# Altium project EE4951_BPM_REV_B.PrjPcb
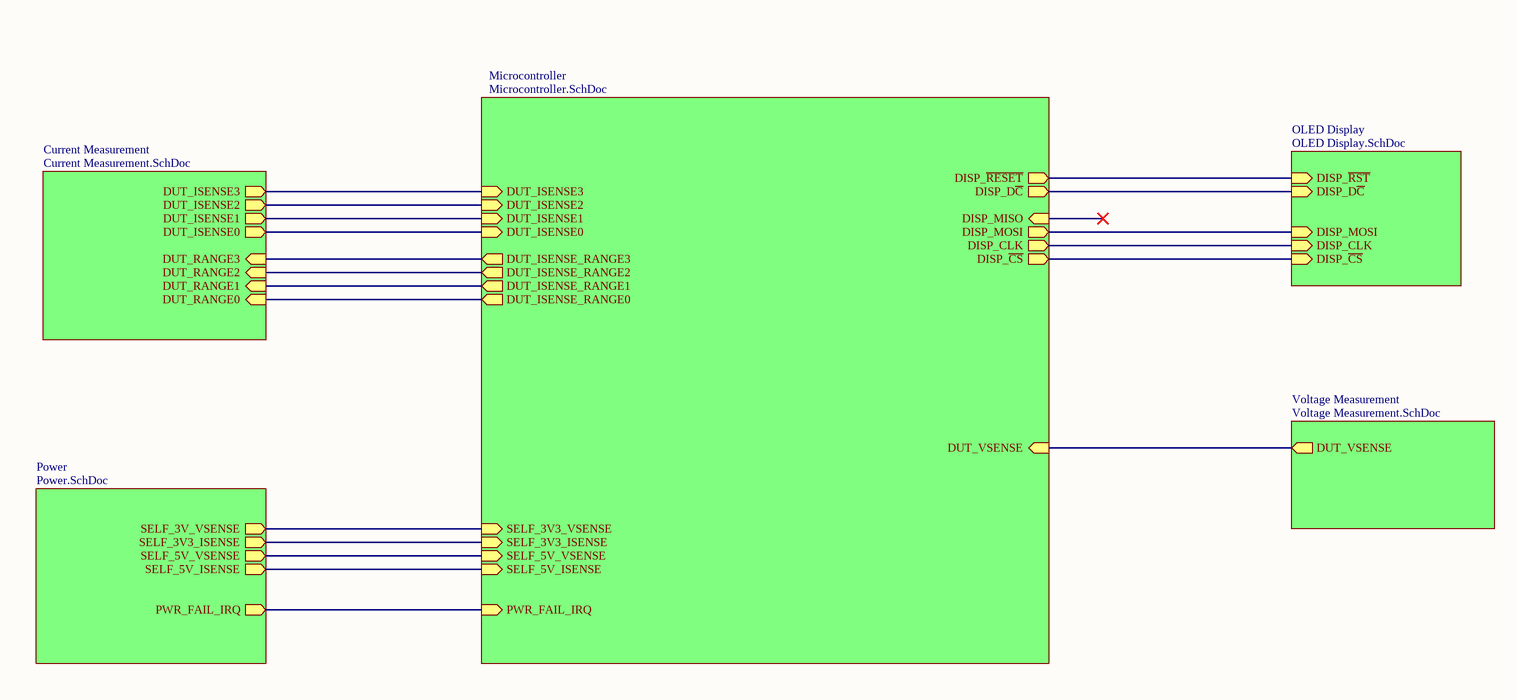
[diagram p0: Heirarchy.SchDoc, left]
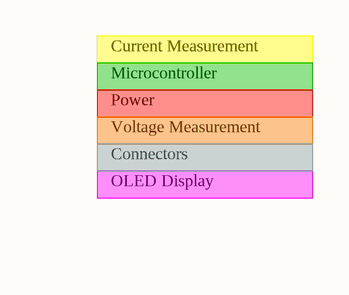
[diagram p1: Heirarchy.SchDoc, right]
3 sheets, 120 parts. Net scope: hierarchical (ports join the sheet entries above them; power ports are global).
Board file: EE4951_BPM_REVA.PcbDoc
Sheets:
  Heirarchy.SchDoc
    Power = Power.SchDoc
    OLED Display = OLED Display.SchDoc

## Sheet Heirarchy.SchDoc
size D; DrawnBy: Ross Harvey; Engineer: Ross Harvey; Revision: A; SheetNumber: 1; SheetTotal: 7

### Sub-sheets
Current Measurement = Current Measurement.SchDoc (file not in this document): DUT_ISENSE2 (out), DUT_ISENSE1 (out), DUT_RANGE2 (in), DUT_RANGE0 (in), DUT_ISENSE3 (out), DUT_RANGE3 (in), DUT_RANGE1 (in), DUT_ISENSE0 (out)
Microcontroller = Microcontroller.SchDoc (file not in this document): DISP_MISO (in), SELF_3V3_ISENSE (in), DISP_CLK (out), PWR_FAIL_IRQ (in), DISP_~{CS} (out), DUT_ISENSE_RANGE1 (out), SELF_5V_VSENSE (in), DUT_ISENSE_RANGE0 (out), DISP_MOSI (out), SELF_5V_ISENSE (in), DUT_VSENSE (in), DUT_ISENSE_RANGE2 (out), DISP_D~{C} (out), DUT_ISENSE_RANGE3 (out), DUT_ISENSE0 (in), DISP_~{RESET} (out), DUT_ISENSE2 (in), DUT_ISENSE3 (in), DUT_ISENSE1 (in), SELF_3V3_VSENSE (in)
OLED Display = OLED Display.SchDoc: DISP_~{CS} (in), DISP_CLK (in), DISP_MOSI (in), DISP_~{RST} (in), DISP_D~{C} (in)
Power = Power.SchDoc: SELF_5V_VSENSE (out), SELF_5V_ISENSE (out), SELF_3V3_ISENSE (out), PWR_FAIL_IRQ (out), SELF_3V_VSENSE (out)
Voltage Measurement = Voltage Measurement.SchDoc (file not in this document): DUT_VSENSE (out)

### Nets
NetC48_1: sheet Microcontroller/SELF_5V_ISENSE, sheet Power/SELF_5V_ISENSE
NetC49_1: sheet Microcontroller/SELF_5V_VSENSE, sheet Power/SELF_5V_VSENSE
NetC54_1: sheet Microcontroller/SELF_3V3_ISENSE, sheet Power/SELF_3V3_ISENSE
NetC70_1: sheet Microcontroller/SELF_3V3_VSENSE, sheet Power/SELF_3V_VSENSE
NetU14_1: sheet Microcontroller/PWR_FAIL_IRQ, sheet Power/PWR_FAIL_IRQ
NetU16_1: sheet Microcontroller/DISP_MOSI, sheet OLED Display/DISP_MOSI
NetU16_2: sheet Microcontroller/DISP_CLK, sheet OLED Display/DISP_CLK
NetU16_3: sheet Microcontroller/DISP_D~{C}, sheet OLED Display/DISP_D~{C}
NetU16_4: sheet Microcontroller/DISP_~{RESET}, sheet OLED Display/DISP_~{RST}
NetU16_5: sheet Microcontroller/DISP_~{CS}, sheet OLED Display/DISP_~{CS}
(unnamed): sheet Current Measurement/DUT_ISENSE2, sheet Microcontroller/DUT_ISENSE2
(unnamed): sheet Current Measurement/DUT_ISENSE1, sheet Microcontroller/DUT_ISENSE1
(unnamed): sheet Current Measurement/DUT_RANGE2, sheet Microcontroller/DUT_ISENSE_RANGE2
(unnamed): sheet Current Measurement/DUT_RANGE0, sheet Microcontroller/DUT_ISENSE_RANGE0
(unnamed): sheet Current Measurement/DUT_ISENSE3, sheet Microcontroller/DUT_ISENSE3
(unnamed): sheet Current Measurement/DUT_RANGE3, sheet Microcontroller/DUT_ISENSE_RANGE3
(unnamed): sheet Current Measurement/DUT_RANGE1, sheet Microcontroller/DUT_ISENSE_RANGE1
(unnamed): sheet Current Measurement/DUT_ISENSE0, sheet Microcontroller/DUT_ISENSE0
(unnamed): sheet Microcontroller/DUT_VSENSE, sheet Voltage Measurement/DUT_VSENSE

### Notes on the sheet
- Current Measurement
- Microcontroller
- Power
- Voltage Measurement
- Connectors
- OLED Display

## Sheet Power.SchDoc
size D; DrawnBy: James Redinger/Ross Harvey; Engineer: JR/AB/RH; Revision: A; SheetNumber: 4; SheetTotal: 7
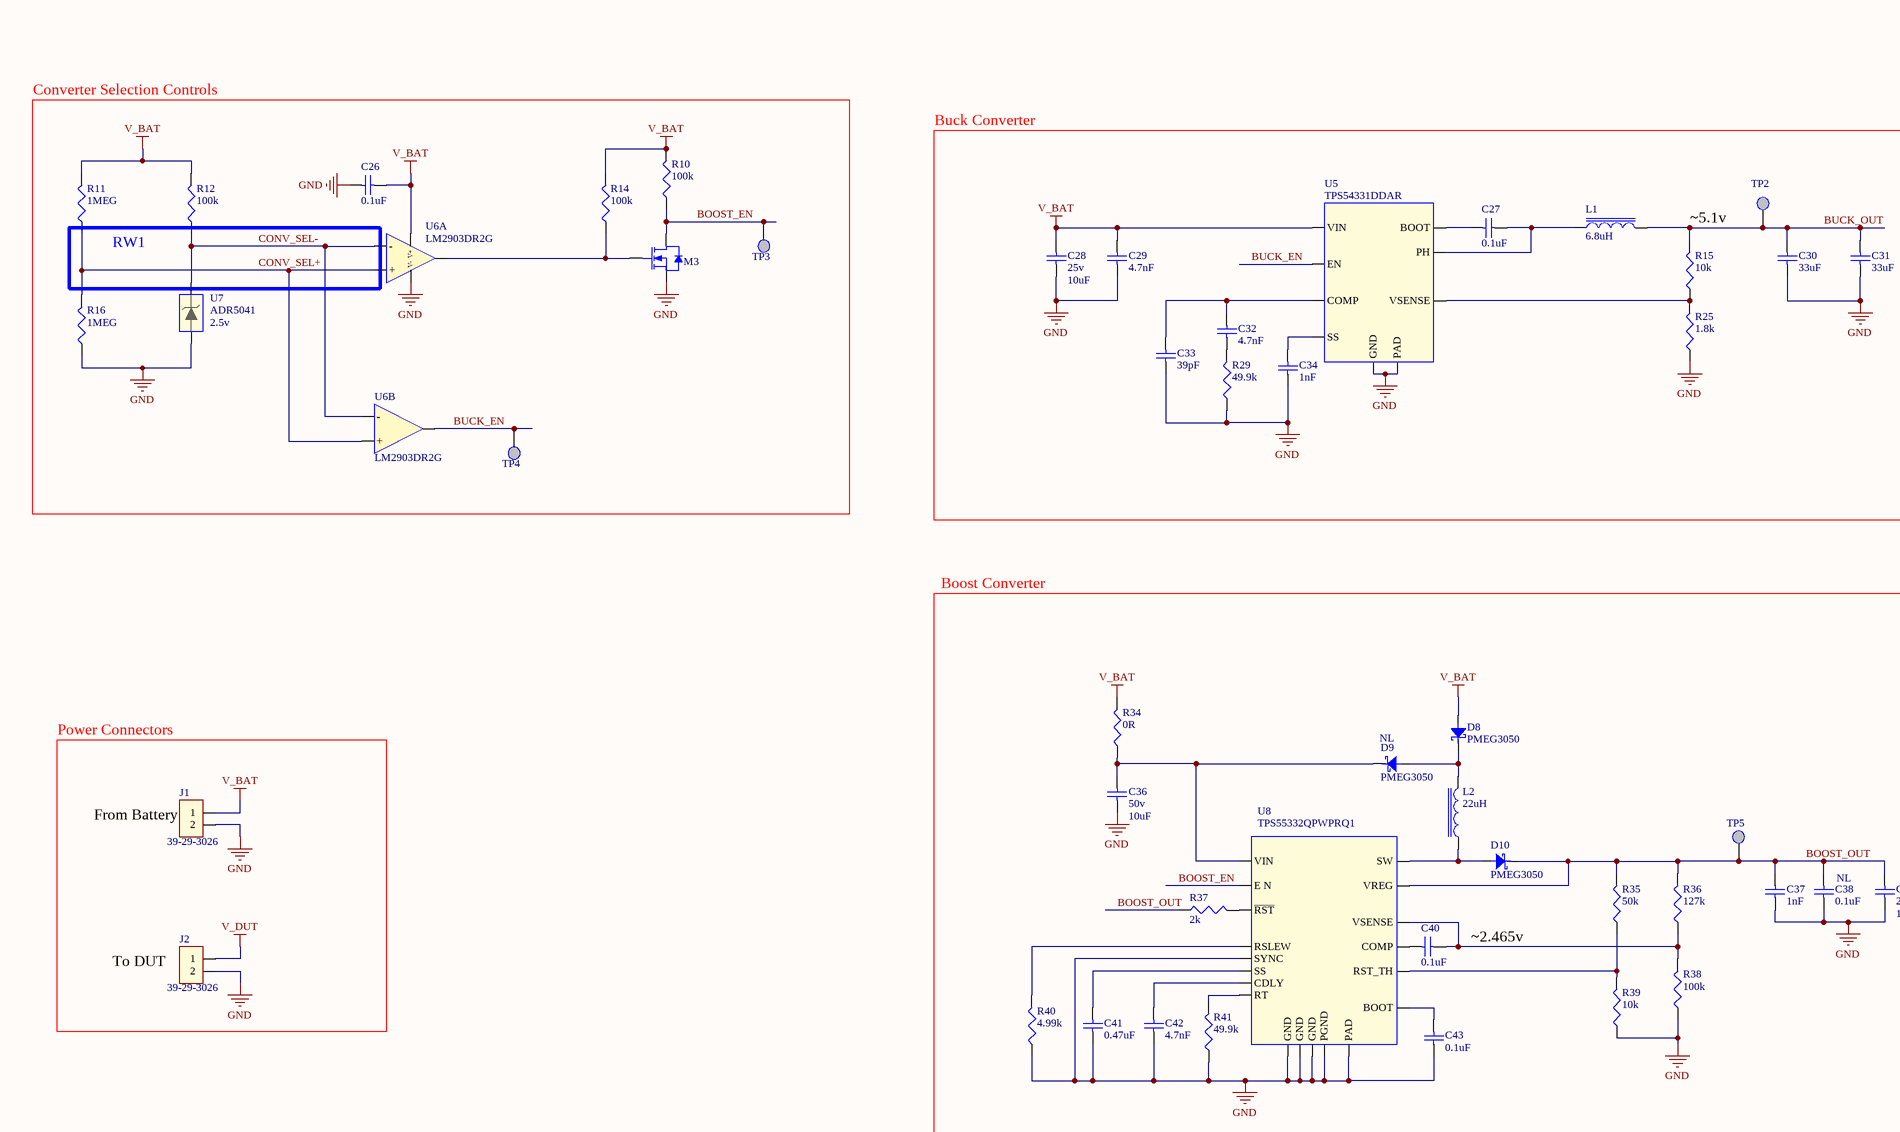
[diagram p2: Power.SchDoc, top left]
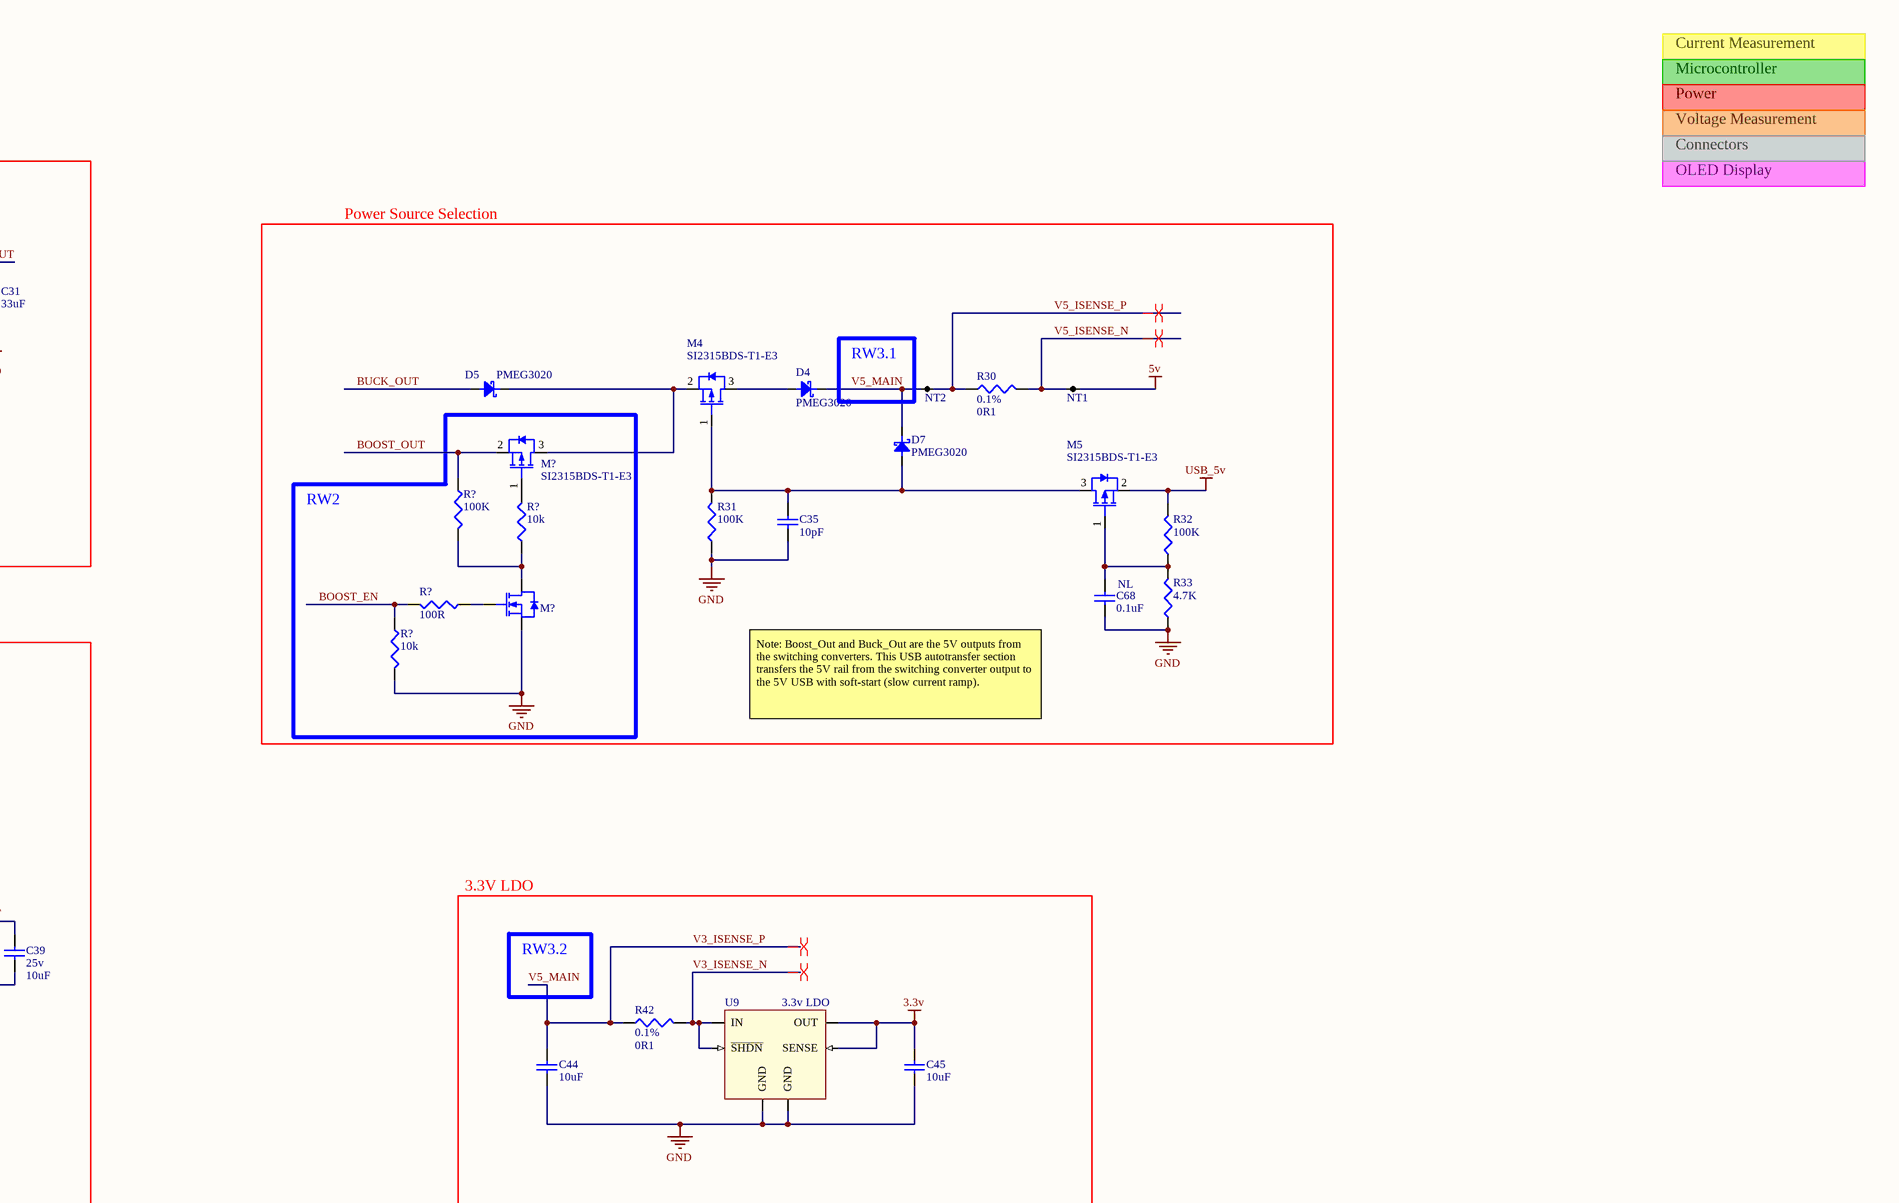
[diagram p3: Power.SchDoc, top right]
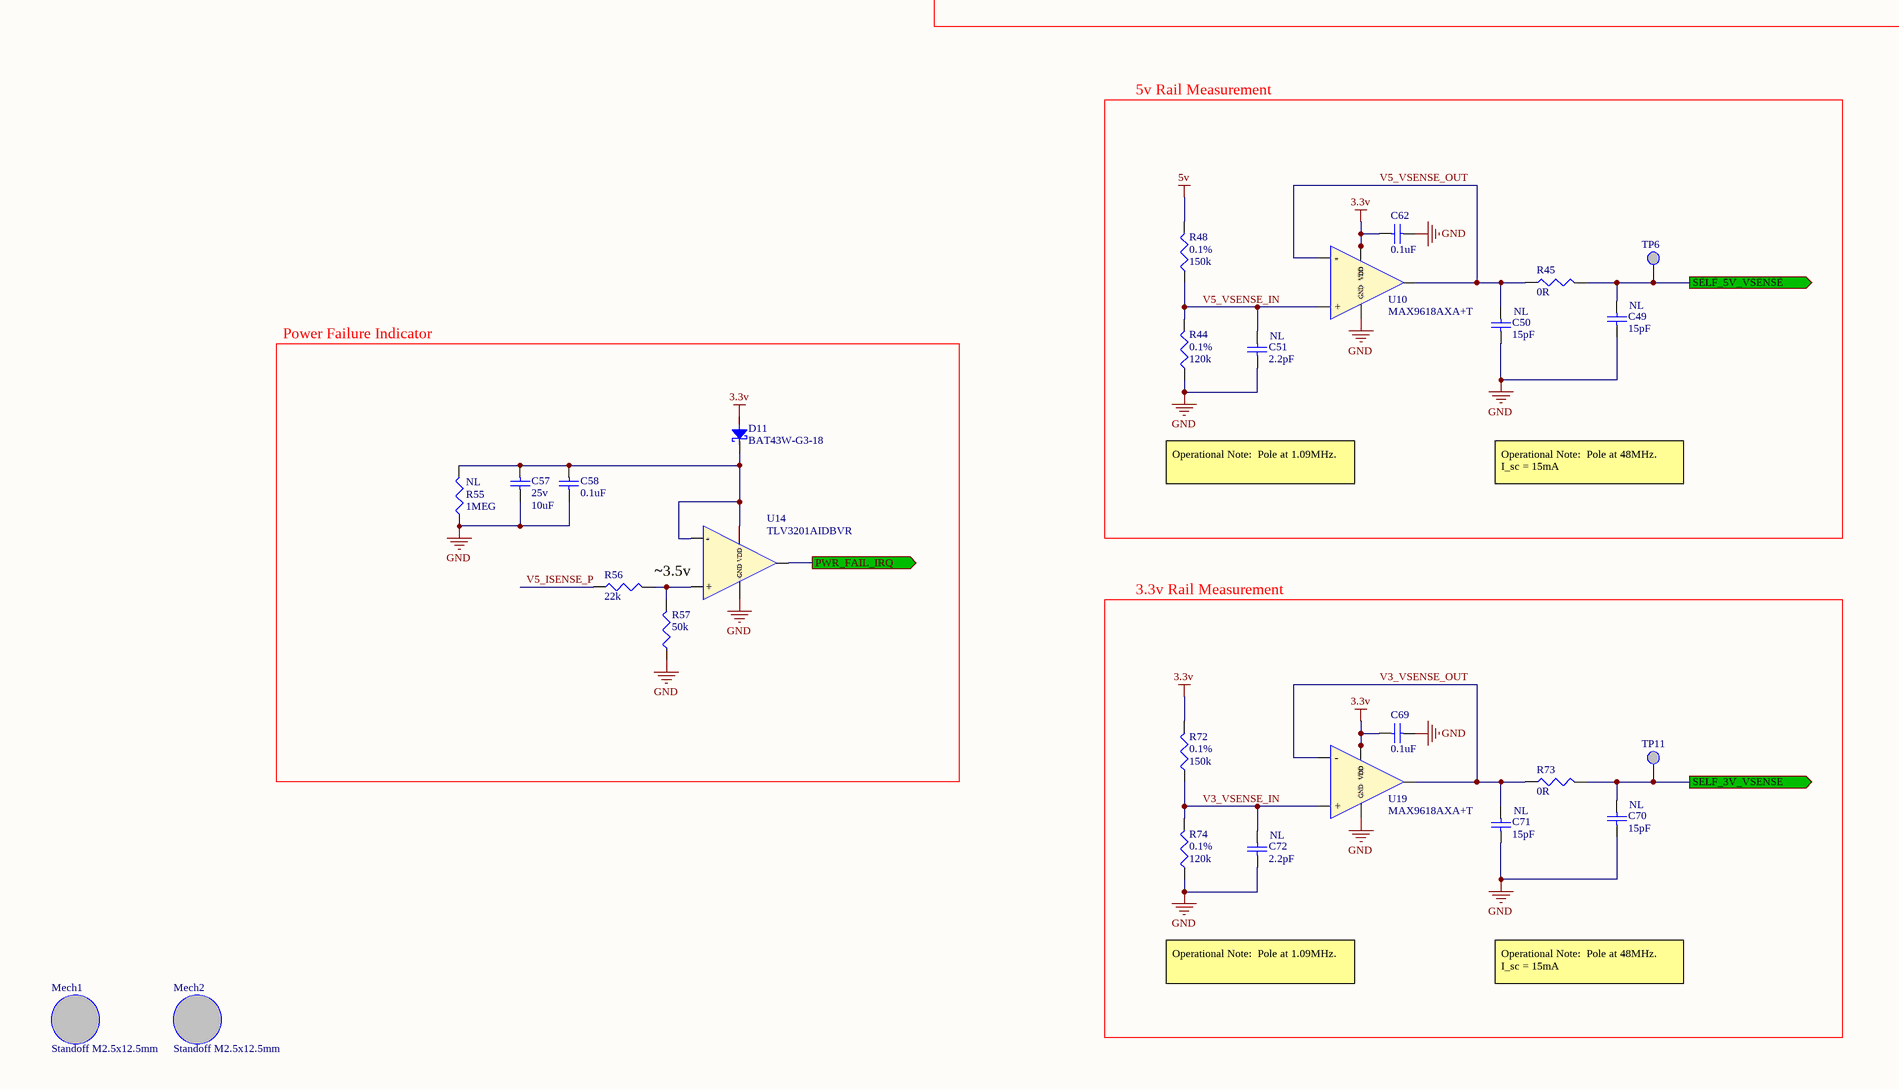
[diagram p4: Power.SchDoc, bottom left]
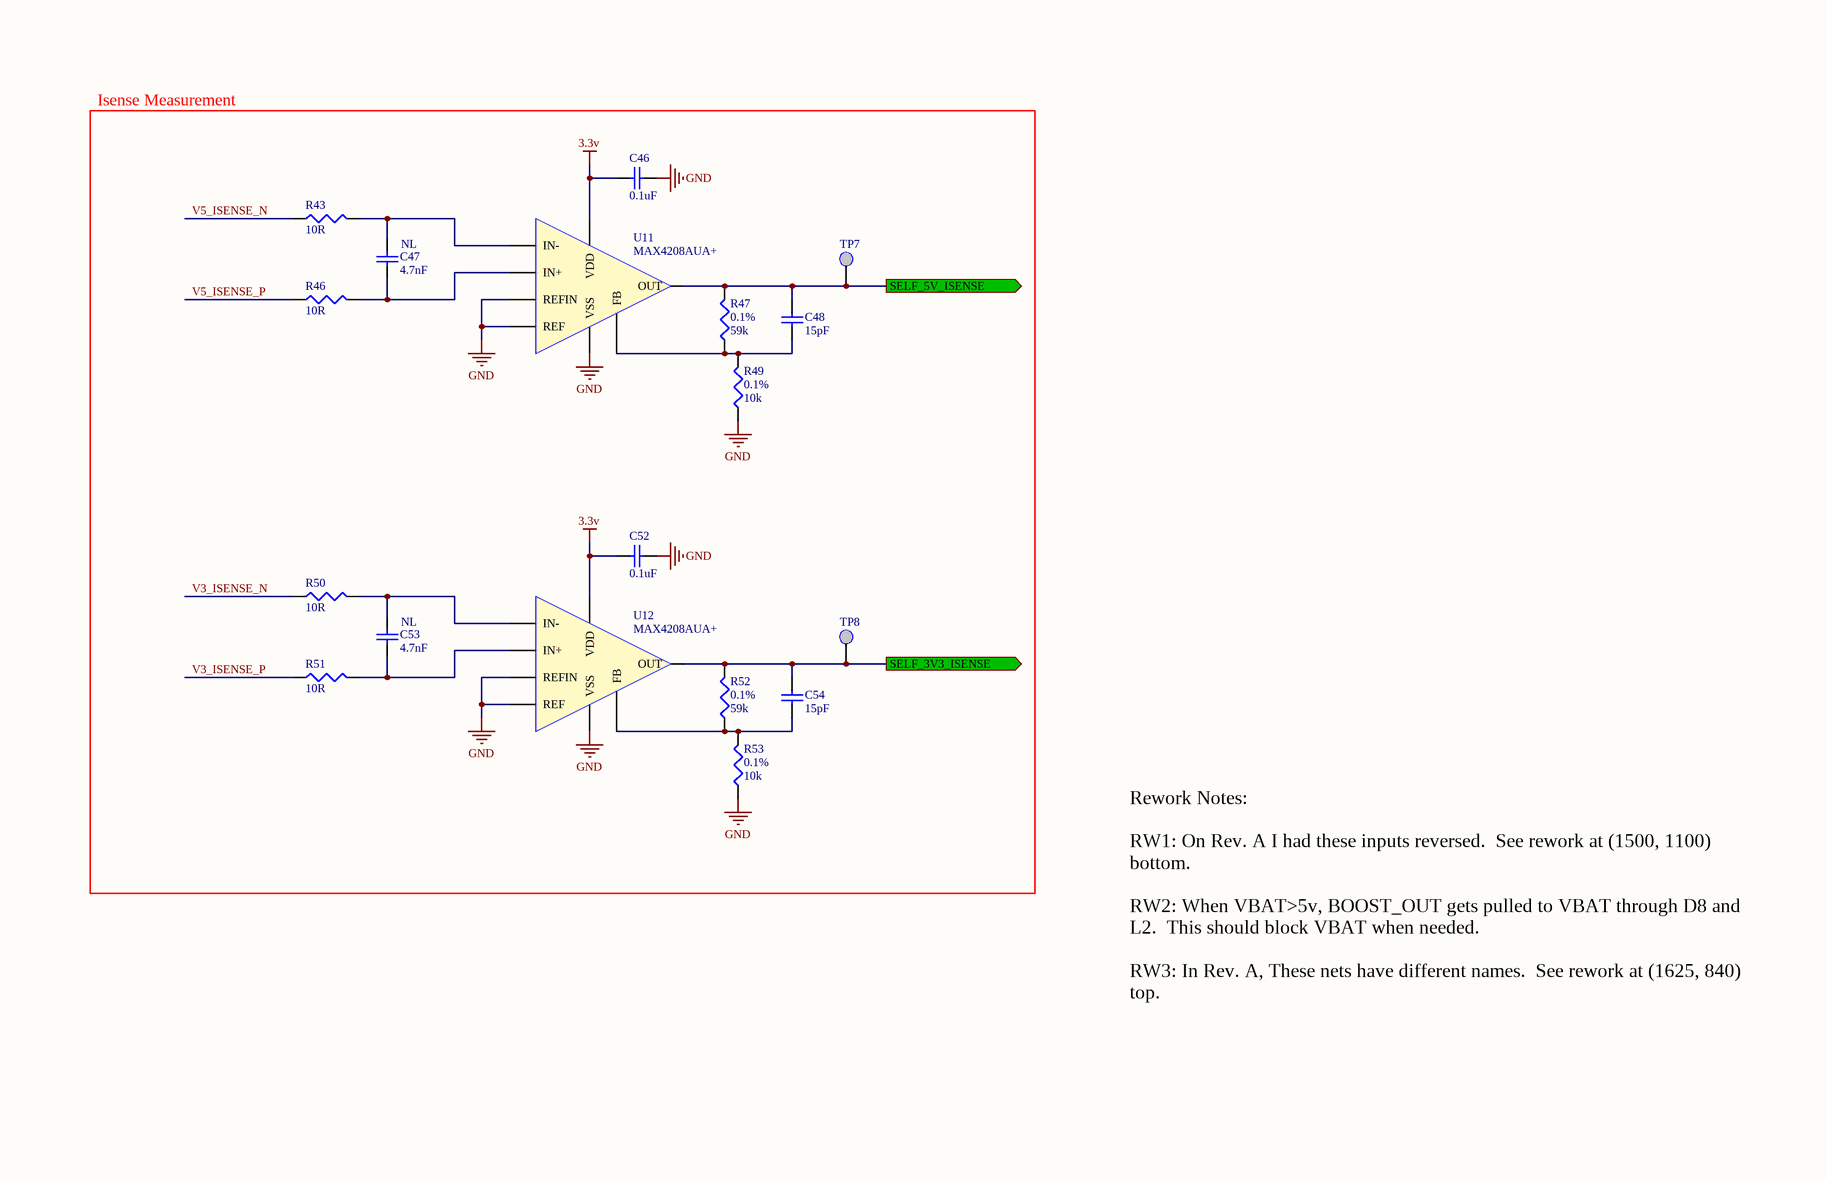
[diagram p5: Power.SchDoc, bottom right]

### Parts
(Parts that share a designator on the sheet are numbered #1, #2 ... from top to bottom, then left to right.)
C26  0.1uF  [CAP0603R]
C27  0.1uF  [CAP0603R]
C28  Voltage: 25v  [CAP1206W]  (hidden comment: 10uF)
C29  4.7nF  [CAP0402R]
C30  33uF  [CAP0805R]
C31  33uF  [CAP0805R]
C32  4.7nF  [CAP0402R]
C33  39pF  [CAP0402R]
C34  1nF  [CAP0402R]
C35  10pF  [CAP0402R]
C36  Voltage: 50v  [CAP1206R]  (hidden comment: 10uF)
C37  1nF  [CAP0402R]
C38  LOAD: NL  [CAP0402R]  (hidden comment: 0.1uF)
C39  Voltage: 25v  [CAP1206W]  (hidden comment: 10uF)
C40  0.1uF  [CAP0402R]
C41  0.47uF  [CAP0805R]
C42  4.7nF  [CAP0402R]
C43  0.1uF  [CAP0603R]
C44  10uF  [CAP0805R]
C45  10uF  [CAP0805R]
C46  0.1uF  [CAP0402R]
C47  LOAD: NL  [CAP0402R]  (hidden comment: 4.7nF)
C48  15pF  [CAP0402R]
C49  LOAD: NL  [CAP0402R]  (hidden comment: 15pF)
C50  LOAD: NL  [CAP0402R]  (hidden comment: 15pF)
C51  LOAD: NL  [CAP0402R]  (hidden comment: 2.2pF)
C52  0.1uF  [CAP0402R]
C53  LOAD: NL  [CAP0402R]  (hidden comment: 4.7nF)
C54  15pF  [CAP0402R]
C57  Voltage: 25v  [CAP1206W]  (hidden comment: 10uF)
C58  0.1uF  [CAP0402R]
C62  0.1uF  [CAP0402R]
C68  LOAD: NL  [CAP0402R]  (hidden comment: 0.1uF)
C69  0.1uF  [CAP0402R]
C70  LOAD: NL  [CAP0402R]  (hidden comment: 15pF)
C71  LOAD: NL  [CAP0402R]  (hidden comment: 15pF)
C72  LOAD: NL  [CAP0402R]  (hidden comment: 2.2pF)
D4  PMEG3020  [SOD-123]
D5  PMEG3020  [SOD-123]
D7  PMEG3020  [SOD-123]
D8  PMEG3050  [SOD128]
D9  PMEG3050  LOAD: NL  [SOD128]
D10  PMEG3050  [SOD128]
D11  BAT43W-G3-18  [SOD-123]
J1  39-29-3026  [1x2 MicroFit]
J2  39-29-3026  [1x2 MicroFit]
L1  6.8uH  [CDRH3D28NP-6R8NC]
L2  22uH  [Bourns_SRR1210]
M3  2N7002P,215  [SOT23-3M]  (value not drawn)
M4  SI2315BDS-T1-E3  [SOT23-3M]
M5  SI2315BDS-T1-E3  [SOT23-3M]
M?#1  SI2315BDS-T1-E3  [SOT23-3M]
M?#2  2N7002P,215  [SOT23-3M]  (value not drawn)
Mech1  Standoff M2.5x12.5mm  [Standoff M2.5x12mm]
Mech2  Standoff M2.5x12.5mm  [Standoff M2.5x12mm]
NT1  Net Tie  [Net Tie]  (value not drawn)  (net tie)
NT2  Net Tie  [Net Tie]  (value not drawn)  (net tie)
R10  100k  [RES0402R]
R11  1MEG  [RES0402R]
R12  100k  [RES0402R]
R14  100k  [RES0402R]
R15  10k  [RES0402R]
R16  1MEG  [RES0402R]
R25  1.8k  [RES0402R]
R29  49.9k  [RES0402R]
R30  Tolerance: 0.1%  [RES1206R]  (hidden comment: 0R1)
R31  100K  [RES0402R]
R32  100K  [RES0402R]
R33  4.7K  [RES0402R]
R34  0R  [RES1206W]
R35  50k  [RES0402R]
R36  127k  [RES0402R]
R37  2k  [RES0402R]
R38  100k  [RES0402R]
R39  10k  [RES0402R]
R40  4.99k  [RES0402R]
R41  49.9k  [RES0402R]
R42  Tolerance: 0.1%  [RES1206R]  (hidden comment: 0R1)
R43  10R  [RES0402R]
R44  Tolerance: 0.1%  [RES0603R]  (hidden comment: 120k)
R45  0R  [RES0402R]
R46  10R  [RES0402R]
R47  Tolerance: 0.1%  [RES0603R]  (hidden comment: 59k)
R48  Tolerance: 0.1%  [RES0603R]  (hidden comment: 150k)
R49  Tolerance: 0.1%  [RES0603R]  (hidden comment: 10k)
R50  10R  [RES0402R]
R51  10R  [RES0402R]
R52  Tolerance: 0.1%  [RES0603R]  (hidden comment: 59k)
R53  Tolerance: 0.1%  [RES0603R]  (hidden comment: 10k)
R55  Load: NL  [RES0402R]  (hidden comment: 1MEG)
R56  22k  [RES0603W]
R57  50k  [RES0402R]
R72  Tolerance: 0.1%  [RES0603R]  (hidden comment: 150k)
R73  0R  [RES0402R]
R74  Tolerance: 0.1%  [RES0603R]  (hidden comment: 120k)
R?#1  100K  [RES0402R]
R?#2  10k  [RES0402R]
R?#3  100R  [RES0402R]
R?#4  10k  [RES0402R]
TP2  NONE  [TESTPOINT - 1.5mm Round Pad]  (value not drawn)
TP3  NONE  [TESTPOINT - 1.5mm Round Pad]  (value not drawn)
TP4  NONE  [TESTPOINT - 1.5mm Round Pad]  (value not drawn)
TP5  NONE  [TESTPOINT - 1.5mm Round Pad]  (value not drawn)
TP6  NONE  [TESTPOINT - 1.5mm Round Pad]  (value not drawn)
TP7  NONE  [TESTPOINT - 1.5mm Round Pad]  (value not drawn)
TP8  NONE  [TESTPOINT - 1.5mm Round Pad]  (value not drawn)
TP11  NONE  [TESTPOINT - 1.5mm Round Pad]  (value not drawn)
U5  TPS54331DDAR  [HSOP-8]
U6  LM2903DR2G  [SOIC-8]  (parts A,B of 2)
U7  ADR5041  VOLTAGE: 2.5v  [SOT23-3M]
U8  TPS55332QPWPRQ1  [HTSSOP-20]
U9  3.3v LDO  [SOT-223-6]
U10  MAX9618AXA+T  [SC70]
U11  MAX4208AUA+  [uMAX8]
U12  MAX4208AUA+  [uMAX8]
U14  TLV3201AIDBVR  [SOT23-5]
U19  MAX9618AXA+T  [SC70]

### Blocks framed on the sheet
RW2: M?#1 M?#2 R?#1-R?#4
5v Rail Measurement: C49-C51 C62 R44 R45 R48 TP6 U10
Isense Measurement: C46-C48 C52-C54 R43 R46 R47 R49-R53 TP7 TP8 U11 U12
3.3v Rail Measurement: C69-C72 R72-R74 TP11 U19

### Ports
PWR_FAIL_IRQ (out), SELF_3V3_ISENSE (out), SELF_3V_VSENSE (out), SELF_5V_ISENSE (out), SELF_5V_VSENSE (out)

### Nets
3.3v: C45.1 C46.1 C52.1 C62.1 C69.1 D11.2(A) R72.2 U9.4(OUT) U9.5(SENSE) U10.5(VDD) U10.6(VDD) U11.8(VDD) U12.8(VDD) U19.5(VDD) U19.6(VDD)
5v: NT1.2 R48.2
GND: C26.1 C28.2 C29.1 C30.2 C31.2 C33.1 C34.2 C35.2 C36.2 C37.2 C38.2 C39.2 C41.1 C42.2 C43.2 C44.2 C45.2 C46.2 C49.2 C50.2 C51.2 C52.2 C57.2 C58.2 C62.2 C68.2 C69.2 C70.2 C71.2 C72.2 J1.2 J2.2 M3.2(SOURCE) M?#2.2(SOURCE) R16.1 R25.1 R29.1 R31.1 R33.1 R38.1 R39.1 R40.1 R41.1 R44.1 R49.1 R53.1 R55.1 R57.1 R74.1 R?#4.2 U5.7(GND) U5.9(PAD) U6.4(V-) U7.2(K) U8.0(PAD) U8.1(NC) U8.2(NC) U8.3(SYNC) U8.4(GND) U8.10(GND) U8.12(GND) U8.17(PGND) U9.3(GND) U9.6(GND) U10.2(GND) U11.1(REFIN) U11.4(VSS) U11.5(REF) U12.1(REFIN) U12.4(VSS) U12.5(REF) U14.2(GND) U19.2(GND)
USB_5v: M5.2(DRAIN) R32.2
V_BAT: C26.2 C28.1 C29.2 D8.2(A) J1.1 R10.2 R11.2 R12.2 R14.2 R34.2 U5.2(VIN) U6.8(V+)
V_DUT: J2.1
BOOST_EN: M3.3(DRAIN) R10.1 R?#3.2 R?#4.1 TP3.1 U8.5(E_N)
BOOST_OUT: C37.1 C38.1 C39.1 D10.1(K) M?#1.2(DRAIN) R35.2 R36.2 R37.1 R?#1.1 TP5.1 U8.16(VREG)
BUCK_EN: TP4.1 U5.3(EN) U6.7(OUT)
BUCK_OUT: C30.1 C31.1 D5.2(A) L1.2 R15.2 TP2.1
CONV_SEL+: R11.1 R16.2 U6.3(+) U6.5(+)
CONV_SEL-: R12.1 U6.2(-) U6.6(-) U7.1(A)
V3_ISENSE_N: R42.2 R50.1 U9.1(~{SHDN}) U9.2(IN)
V3_ISENSE_P: C44.1 D4.1(K) D7.1(K) NT2.2 R42.1 R51.1  [also labelled V5_MAIN]
V3_VSENSE_IN: C72.1 R72.1 R74.2 U19.1(+)
V3_VSENSE_OUT: C71.1 R73.1 U19.3(-) U19.4(OUT)
V5_ISENSE_N: NT1.1 R30.2 R43.1
V5_ISENSE_P: NT2.1 R30.1 R46.1 R56.1
V5_VSENSE_IN: C51.1 R44.2 R48.1 U10.1(+)
V5_VSENSE_OUT: C50.1 R45.1 U10.3(-) U10.4(OUT)
NetC27_1: C27.1 U5.1(BOOT)
NetC27_2: C27.2 L1.1 U5.8(PH)
NetC32_1: C32.1 R29.2
NetC32_2: C32.2 C33.2 U5.6(COMP)
NetC34_1: C34.1 U5.4(SS)
NetC35_1: C35.1 D7.2(A) M4.1(GATE) M5.3(SOURCE) R31.2
NetC36_1: C36.1 D9.1(K) R34.1 U8.19(VIN)
NetC40_1: C40.1 U8.15(COMP)
NetC40_2: C40.2 R36.1 R38.2 U8.14(VSENSE)
NetC41_2: C41.2 U8.11(SS)
NetC42_1: C42.1 U8.9(CDLY)
NetC43_1: C43.1 U8.20(BOOT)
NetC47_1: C47.1 R43.2 U11.2(IN-)
NetC47_2: C47.2 R46.2 U11.3(IN+)
NetC48_1: C48.1 R47.2 TP7.1 U11.7(OUT) ; port SELF_5V_ISENSE
NetC48_2: C48.2 R47.1 R49.2 U11.6(FB)
NetC49_1: C49.1 R45.2 TP6.1 ; port SELF_5V_VSENSE
NetC53_1: C53.1 R50.2 U12.2(IN-)
NetC53_2: C53.2 R51.2 U12.3(IN+)
NetC54_1: C54.1 R52.2 TP8.1 U12.7(OUT) ; port SELF_3V3_ISENSE
NetC54_2: C54.2 R52.1 R53.2 U12.6(FB)
NetC57_1: C57.1 C58.1 D11.1(K) R55.2 U14.4(-) U14.5(VDD)
NetC68_1: C68.1 M5.1(GATE) R32.1 R33.2
NetC70_1: C70.1 R73.2 TP11.1 ; port SELF_3V_VSENSE
NetD4_2: D4.2(A) M4.3(SOURCE)
NetD5_1: D5.1(K) M4.2(DRAIN) M?#1.3(SOURCE)
NetD8_1: D8.1(K) D9.2(A) L2.2
NetD10_2: D10.2(A) L2.1 U8.18(SW)
NetM3_1: M3.1(GATE) R14.1 U6.1(OUT1)
NetM?#1_1: M?#1.1(GATE) R?#2.2
NetM?#2_1: M?#2.1(GATE) R?#3.1
NetM?#2_3: M?#2.3(DRAIN) R?#1.2 R?#2.1
NetR15_1: R15.1 R25.2 U5.5(VSENSE)
NetR35_1: R35.1 R39.2 U8.13(RST_TH)
NetR37_2: R37.2 U8.8(~{RST})
NetR40_2: R40.2 U8.7(RSLEW)
NetR41_2: R41.2 U8.6(RT)
NetR56_2: R56.2 R57.2 U14.3(+)
NetU14_1: U14.1(OUT) ; port PWR_FAIL_IRQ

Not connected (* = marked no-connect by the designer): Mech1 1; Mech2 1; U7 3(NC)

### Layout directives
differential pair: V3_ISENSE_N, V3_ISENSE_P, V5_ISENSE_N, V5_ISENSE_P

### Notes on the sheet
- Current Measurement
- Microcontroller
- Power
- Converter Selection Controls
- Buck Converter
- Voltage Measurement
- Connectors
- Power Source Selection
- OLED Display
- (near R11) RW1
- ~5.1v
- RW3.1
- Boost Converter
- Note: Boost_Out and Buck_Out are the 5V outputs from the switching converters. This USB autotransfer section transfers the 5V rail from the switching converter output to the 5V USB with soft-start (slow current ramp).
- Power Connectors
- (near J1) From Battery
- 3.3V LDO
- RW3.2
- (near J2) To DUT
- (near C40) ~2.465v
- Power Failure Indicator
- Operational Note:  Pole at 1.09MHz.
- Operational Note:  Pole at 48MHz.
  I_sc = 15mA
- ~3.5v
- Rework Notes:
  RW1: On Rev. A I had these inputs reversed.  See rework at (1500, 1100) bottom.
  RW2: When VBAT>5v, BOOST_OUT gets pulled to VBAT through D8 and L2.  This should block VBAT when needed.
  RW3: In Rev. A, These nets have different names.  See rework at (1625, 840) top.

### Library data of the parts
C26 C27 C43 = 0.1uF 50v (0603): MFG_PN: VJ0603V104ZXAPW1BC; MFG: Vishay; Voltage: 50v; LOAD: NL; Value: 0.1uF
C28 C39 C57 = 10uF (1206): Tolerance: 10%; MFG_PN: GRJ31CR71E106KE11L; MFG: MURATA; LOAD: NL; Value: 10uF
C29 C32 = 4.7uF: Tolerance: 10%; MFG1_PN: C1005X7R1H472K050BA; MFG1: TDK; Voltage: 50v; Value: 4.7nF
C30 C31 = 33uF (0805): MFG_PN: C2012X5R1A336M125AC; MFG: TDK; Voltage: 10v; LOAD: NL; Value: 33uF
C33 = Generic Ceramic Capacitor: Tolerance: 5%; MFG1_PN: C1005C0G1H390J050BA; MFG1: TDK; Voltage: 50V; LOAD: NL; Value: 39pF
C34 C37 = 1nF (0402): Tolerance: 10%; MFG_PN: VJ0402Y102KXAAC; MFG: Vishay; Voltage: 50v; LOAD: NL; Value: 1nF
C35 = 10pF (0402): Tolerance: 5%; MFG_PN: VJ0402A100JXACW1BC; MFG: Vishay; Voltage: 50v; LOAD: NL; Value: 10pF
C36 = 10uF 50v (1206): Tolerance: 10%; MFG_PN: C3216X5R1H106K160AB; MFG: TDK; LOAD: NL; Value: 10uF
C38 C68 = 0.1uF (0402): Tolerance: 20%; MFG_PN: VJ0402G104MXQCW1BC; MFG: Vishay; Voltage: 10v; Value: 0.1uF
C40 C46 C52 C58 C62 C69 = 0.1uF (0402): Tolerance: 20%; MFG_PN: VJ0402G104MXQCW1BC; MFG: Vishay; Voltage: 10v; LOAD: NL; Value: 0.1uF
C41 = 0.47uF (0805): MFG_PN: VJ0805V474MXXCW1BC; MFG: Vishay; Voltage: 25v; LOAD: NL; Value: 0.47uF
C42 = 4.7nF (0402): Tolerance: 10%; MFG_PN: VJ0402Y472KXACW1BC; MFG: Vishay; Voltage: 50v; LOAD: NL; Value: 4.7nF
C44 C45 = Generic Ceramic Capacitor: Tolerance: 10%; MFG1_PN: C2012X5R1A106K125AB; MFG1: TDK; Voltage: 10V; LOAD: NL; Value: 10uF
C47 C53 = 4.7nF (0402): Tolerance: 10%; MFG_PN: VJ0402Y472KXACW1BC; MFG: Vishay; Voltage: 50v; Value: 4.7nF
C48 C54 = 15pF (0402): Tolerance: 5%; MFG_PN: VJ0402A150JXACW1BC; MFG: Vishay; Voltage: 50v; LOAD: NL; Value: 15pF
C49 C50 C70 C71 = 15pF (0402): Tolerance: 5%; MFG_PN: VJ0402A150JXACW1BC; MFG: Vishay; Voltage: 50v; Value: 15pF
C51 C72 = 2.2pF (0402): Tolerance: 10%; MFG_PN: VJ0402A2R2DXXCW1BC; MFG: Vishay; Voltage: 25v; Value: 2.2pF
D4 D5 D7 = PMEG3020ER,115: Schottky Diode - 2A; MFG: NXP; VF: 365mV; LOAD: NL; Value: *; CURRENT: 2A; MFG_PN: PMEG3020ER,115
D8-D10 = PMEG3050BEP: MFG: NXP; CURRENT: 5A; VF: 0.45v; MFG_PN: PMEG3050BEP,115; Value: *
D11 = BAT43: MFG: Vishay; Value: *; MFG_PN: BAT43W-G3-18
J1 J2 = 1x2 Microfit: MFG: MOLEX; CURRENT: 9A; MFG_PN: 39-29-3026; MATES_WITH_HOUSING: 39-01-2020; MATES_WITH_PIN: 39-00-0038
L1 = 6.8uH Power Inductor: 6.8uH Shielded Power Inductor; MFG: SUMIDA; CURRENT: 1.32A; SHIELDED: TRUE; LOAD: NL; RESISTANCE: 119m; MFG_PN: CDRH3D28NP-6R8NC; Value: 6.8uH
L2 = 22uH_SRR1210: MFG: Bourns; MFG_PN: SRR1210-220M; CURRENT: 5.2A; Value: 22uH
M3 M?#2 = 2N7002: NFET_SINGLE_360mA_60V; LOAD: NL; MFG: NXP; VDS_MAX: 60v; I_MAX: 360mA; VGS_MAX: 20v; P_MAX: *; RDS_ON: *; MFG_PN: 2N7002P,215
M4 M5 M?#1 = Generic PFET: LOAD: NL; MFG: Vishay; VDS_MAX: 12V; I_MAX: 3A; VGS_MAX: 8V; P_MAX: 0.75W; RDS_ON: 50m; VGS_THRESHOLD: 0.9V; MFG_PN: SI2315BDS-T1-E3
Mech1 Mech2 = Standoff M2.5x12.5mm: MFG: KEYSTONE; MFG_PN: 24284
NT1 NT2 = Net Tie: Net Tie Testpoint w/ Hook; MFG_PN: 5015; MFG: KEYSTONE; LOAD: NL
R10 R12 R14 R38 = 100k (0402): Tolerance: 1%; POWER: 63mW; MFG_PN: CRCW0402100KFKED; MFG: Vishay; Load: NL; Value: 100k
R11 R16 = 1MEG (0402): Tolerance: 1%; POWER: 63mW; MFG_PN: CRCW04021M00FKED; MFG: Vishay; Load: NL; Value: 1MEG
R15 R39 R?#2 R?#4 = 10k (0402): Tolerance: 1%; POWER: 63mW; MFG_PN: CRCW040210K0FKED; MFG: Vishay; Load: NL; Value: 10k
R25 = 1.8k (0402): Tolerance: 1%; POWER: 63mW; MFG_PN: CRCW04021K80FKED; MFG: Vishay; Load: NL; Value: 1.8k
R29 R41 = 49.9k (0402): Tolerance: 1%; POWER: 63mW; MFG_PN: CRCW040249K9FKED; MFG: Vishay; Load: NL; Value: 49.9k
R30 R42 = 100m 0.1% (1206): POWER: 1W; MFG_PN: WSL1206R1000DEA; MFG: Vishay; Load: NL; Value: 0R1
R31 R32 R?#1 = Generic Resistor: Tolerance: 1%; POWER: 1/16W; MFG_PN: CRCW0402100KFKED; MFG: Vishay; Load: NL; Value: 100K
R33 = Generic Resistor: Tolerance: 1%; POWER: 1/16W; MFG_PN: CRCW04024K70FKED; MFG: Vishay; Load: NL; Value: 4.7K
R34 = 0R (1206): 0R, 1206; MFG_PN: CRCW12060000Z0EA; MFG: Vishay; Load: NL; Value: 0R
R35 R57 = 50k (0402): Tolerance: 1%; POWER: 63mW; MFG_PN: CRCW040250K0FKED; MFG: Vishay; Load: NL; Value: 50k
R36 = 127k (0402): Tolerance: 1%; POWER: 63mW; MFG_PN: CRCW0402127KFKED; MFG: Vishay; Load: NL; Value: 127k
R37 = 2k (0402): Tolerance: 1%; POWER: 63mW; MFG_PN: CRCW04022K00FKED; MFG: Vishay; Load: NL; Value: 2k
R40 = 4.99k (0402): Tolerance: 1%; POWER: 63mW; MFG_PN: CRCW04024K99FKED; MFG: Vishay; Load: NL; Value: 4.99k
R43 R46 R50 R51 = 10R (0402): Tolerance: 1%; POWER: 63mW; MFG_PN: CRCW040210R0FKED; MFG: Vishay; Load: NL; Value: 10R
R44 R74 = 120k 0.1% (0603): POWER: 100mW; MFG_PN: TNPW0603120KBEEA; MFG: Vishay; Load: NL; Value: 120k
R45 R73 = 0R (0402): MFG_PN: CRCW04020000Z0ED; MFG: Vishay; Load: NL; Value: 0R
R47 R52 = 59k   0.1% (0603): POWER: 0.1W; MFG_PN: TNPW060359K0BEEA; MFG: Vishay; Load: NL; Value: 59k
R48 R72 = 150k 0.1% (0603): POWER: 100mW; MFG_PN: TNPW0603150KBEEA; MFG: Vishay; Load: NL; Value: 150k
R49 R53 = 10k   0.1% (0603): POWER: 0.1W; MFG_PN: TNPW060310K0BEEA; MFG: Vishay; Load: NL; Value: 10k
R55 = 1MEG (0402): Tolerance: 1%; POWER: 63mW; MFG_PN: CRCW04021M00FKED; MFG: Vishay; Value: 1MEG
R56 = 22k (0603): Tolerance: 1%; POWER: 0.1W; MFG_PN: CRCW060322K0FKEA; MFG: Vishay; Load: NL; Value: 22k
R?#3 = 100R (0402): Tolerance: 1%; POWER: 63mW; MFG_PN: CRCW0402100RFKED; MFG: Vishay; Load: NL; Value: 100R
TP2-TP8 TP11 = Testpoint 1.5mm SMD: 1.5mm Testpoint
U5 = TPS54331: Buck Converter - Adj. Output - 3A Max; MFG: TI; VOUT: ADJ; VIN_MAX: 28v; LOAD: NL; MFG_PN: TPS54331DDAR; CURRENT: 3A
U6 = LM2903DR2G: Dual Comparator - Open Collector; MFG: ON SEMI; VMAX: 36v; VMIN: 2v; MFG_PN: LM2903DR2G; FUNCTION: *
U7 = ADR5045AKSZ: Precision 5v Reference; LOAD: NL; MFG: ANALOG DEVICES; IMIN: 15uA; IMAX: 15mA; MFG_PN: ADR5041BKSZ-REEL7
U8 = TPS55332QPWPRQ1: Boost Converter - Wide Input Voltage; LOAD: NL; MFG: TI; VIN_MAX: 40v; VIN_MIN: 1.5v; VOUT_MAX: 50V; VOUT_MIN: 2.5v; SWITCH_CURRENT: 5.7A; MFG_PN: TPS55332QPWPRQ1
U9 = TPS7A4533DCQR: MFG: TI; MFG_PN: TPS7A4533DCQR; FUNCTION: 3.3v LDO
U10 U19 = MAX9618AXA: Op Amp - 1 Channel Zero Drift; LOAD: NL; MFG: MAXIM; GBP: 1.5MHz; MFG_PN: MAX9618AXA+T
U11 U12 = MAX4208: Instrumentation Amplifier; MFG: MAXIM; GBP: 750KhZ; IN_BIAS_CURRENT: 1pA; IN_OFFSET_VOLTAGE: 3uV; GAIN: ADJ; IOUT_MAX: 25mA; I_QUIESCENT: 3mA; MFG_PN: MAX4208AUA+
U14 = TLV3201AIDBVR: High Speed Analog Comparator; LOAD: NL; MFG: TI; OUTPUT_TYPE: PUSH-PULL; RESPONSE_TIME: 47ns; MFG_PN: TLV3201AIDBVR

## Sheet OLED Display.SchDoc
size B; SheetNumber: 7; SheetTotal: 7
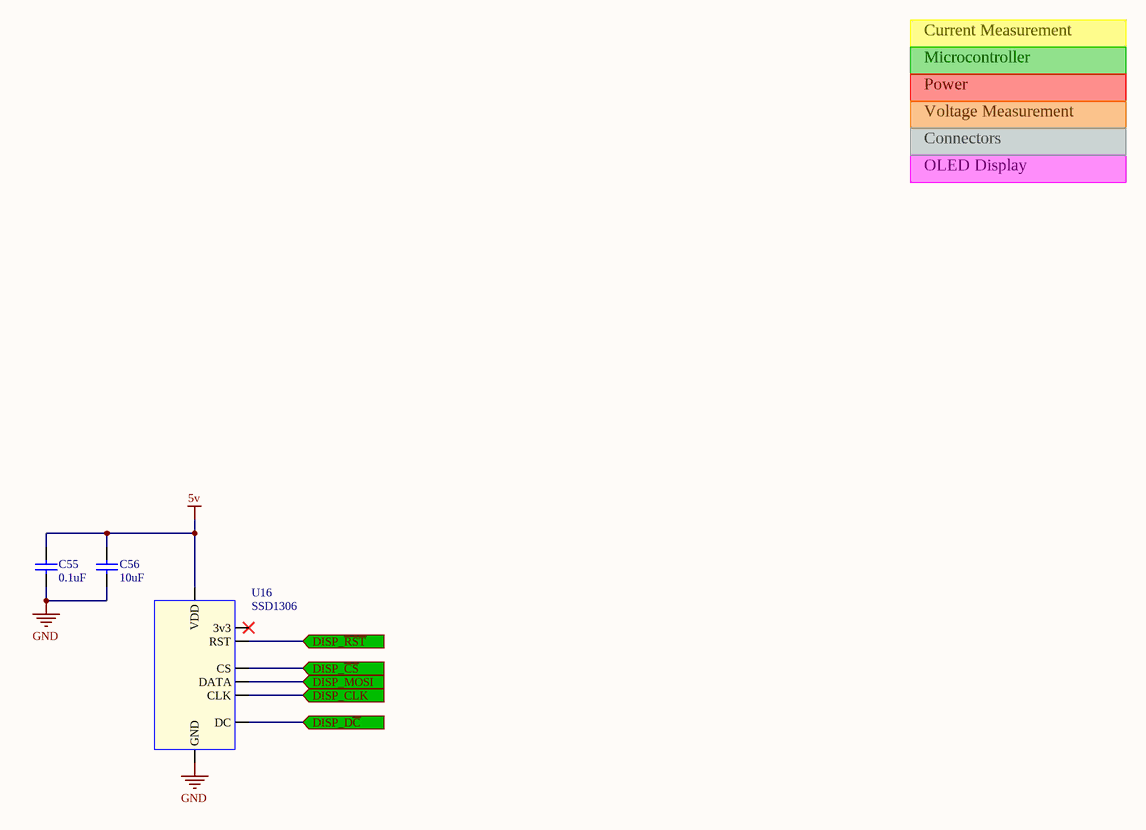
[diagram p6: OLED Display.SchDoc]

### Parts
C55  0.1uF  [CAP0402R]
C56  10uF  [CAP1206R]
U16  SSD1306  [SSD1306]

### Ports
DISP_CLK (in), DISP_D~{C} (in), DISP_MOSI (in), DISP_~{CS} (in), DISP_~{RST} (in)

### Nets
5v: C55.1 C56.1 U16.7(VDD)
GND: C55.2 C56.2 U16.8(GND)
NetU16_1: U16.1(DATA) ; port DISP_MOSI
NetU16_2: U16.2(CLK) ; port DISP_CLK
NetU16_3: U16.3(DC) ; port DISP_D~{C}
NetU16_4: U16.4(RST) ; port DISP_~{RST}
NetU16_5: U16.5(CS) ; port DISP_~{CS}

Not connected (* = marked no-connect by the designer): U16 6(3v3)*

### Notes on the sheet
- Current Measurement
- Microcontroller
- Power
- Voltage Measurement
- OLED Display
- Connectors

### Library data of the parts
C55 = 0.1uF (0402): as C40 on sheet Power; Value: 0.1uF
C56 = 10uF: MFG1_PN: VJ1206V106ZXQTW1BC; MFG1: Vishay; Value: 10uF
U16 = SSD1306: OLED Display; MFG: ADAFRUIT; MFG_PN: SSD1306

## Nets that join several sheets
5v: Power (NT1.2 R48.2), OLED Display (C55.1 C56.1 U16.7)
GND: Power (73 pins), OLED Display (C55.2 C56.2 U16.8)